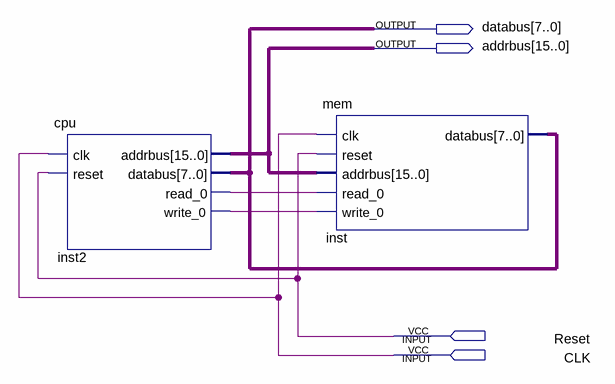
[diagram p0: schematic sheet]
// Quartus schematic comp.bdf as structural Verilog: 2 symbols, 4 pins
module comp (
  input  Reset,
  input  CLK,
  output [7:0] databus,
  output [15:0] addrbus
);

  wire inst2_read_0, inst2_write_0;

  cpu inst2 (
    .clk(CLK), .reset(Reset), .addrbus(addrbus), .read_0(inst2_read_0), .write_0(inst2_write_0),
    .databus(databus));
  mem inst (
    .clk(CLK), .reset(Reset), .addrbus(addrbus), .read_0(inst2_read_0), .write_0(inst2_write_0),
    .databus(databus));
endmodule
